# EAGLE design TwinklingPendant (EAGLE 7.6.0)

## Sheet 1 of 2
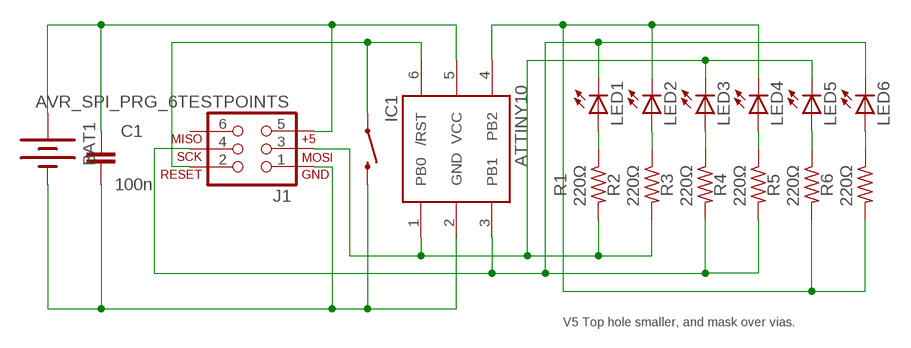
[diagram p0: schematic, sheet 1]

### Parts
BAT1  BATTERY12MM  [BATTCON_12MM]
C1  100n  CAP0603-CAP  [0603-CAP]
IC1  ATTINY10  [SOT23-6]
J1  AVR_SPI_PRG_6TESTPOINTS  [2X3_TEST_POINTS]
LED1  LEDCHIPLED_0805  [CHIPLED_0805]
LED2  LEDCHIPLED_0805  [CHIPLED_0805]
LED3  LEDCHIPLED_0805  [CHIPLED_0805]
LED4  LEDCHIPLED_0805  [CHIPLED_0805]
LED5  LEDCHIPLED_0805  [CHIPLED_0805]
LED6  LEDCHIPLED_0805  [CHIPLED_0805]
R1  220Ω  R-US_R0805  [R0805]
R2  220Ω  R-US_R0805  [R0805]
R3  220Ω  R-US_R0805  [R0805]
R4  220Ω  R-US_R0805  [R0805]
R5  220Ω  R-US_R0805  [R0805]
R6  220Ω  R-US_R0805  [R0805]
S2  SWITCH-MOMENTARY-2SMD  [TACTILE-SWITCH-SMD]

### Nets
N$1: BAT1.PWR@1(+) C1.1 IC1.5(VCC) J1.5
N$2: IC1.6(/RST) J1.2 S2.1
N$3: LED2.A R2.1
N$4: LED1.A R1.1
N$5: LED3.A R3.1
N$6: IC1.1(PB0) J1.3 LED3.C LED5.C R1.2 R2.2
N$7: BAT1.GND(-) C1.2 IC1.2(GND) J1.1 S2.3
N$8: IC1.4(PB2) LED2.C LED4.C R5.2 R6.2
N$9: LED4.A R4.1
N$11: LED5.A R5.1
N$12: LED6.A R6.1
N$14: IC1.3(PB1) J1.4 LED1.C LED6.C R3.2 R4.2
Unconnected: J1.6

### Notes on the sheet
- V5 Top hole smaller, and mask over vias.

## Sheet 2 of 2

## Library data of the parts
BAT1 = SparkFun-Electromechanical:BATTERY: Battery Holders Various common sizes : AA, AAA, 18650 (PRT-12895), 20mm coin cell and 12mm coin cell. 20MM_4LEGS, BATT-10373; PROD_ID: BATT-08044
C1 = SparkFun-Capacitors:CAP: Capacitor Standard 0603 ceramic capacitor, and 0.1" leaded capacitor.
IC1 = adafruit:ATTINY10: ATtiny4/5/9/10 8-bit Microcontroller with 512/1024 Bytes In-System Programmable Flash
J1 = technoblogy:AVR_SPI_PRG_6: AVR ISP 6 Pin This is the reduced ISP connector for AVR programming. Common on Arduino. This footprint will take up less PCB space and can be used with a 10-pin to 6-pin adapter such as SKU: BOB-08508 **Special note about "TEST_POINT" package. The stop mask is on the top side, so if you want your programming test points to be on the bottom of your board, make sure to place this package on the bottom side of the board. This also ensure that the orientation to program from the bottom side will be correct.
LED1-LED6 = adafruit:LED: LED OSRAM: - CHIPLED LG R971, LG N971, LY N971, LG Q971, LY Q971, LO R971, LY R971 LH N974, LH R974 LS Q976, LO Q976, LY Q976 LO Q996 - Hyper CHIPLED LW Q18S LB Q993, LB Q99A, LB R99A - SideLED LS A670, LO A670, LY A670, LG A670, LP A670 LB A673, LV A673, LT A673, LW A673 LH A674 LY A675 LS A676, LA A676, LO A676, LY A676, LW A676 LS A679, LY A679, LG A679 - Hyper Micro SIDELED® LS Y876, LA Y876, LO Y876, LY Y876 LT Y87S - SmartLED LW L88C, LW L88S LB L89C, LB L89S, LG L890 LS L89K, LO L89K, LY L89K LS L896, LA L896, LO L896, LY L896 - TOPLED LS T670, LO T670, LY T670, LG T670, LP T670 LSG T670, LSP T670, LSY T670, LOP T670, LYG T670 LG T671, LOG T671, LSG T671 LB T673, LV T673, LT T673, LW T673 LH T674 LS T676, LA T676, LO T676, LY T676, LB T676, LH T676, LSB T676, LW T676 LB T67C, LV T67C, LT T67C, LS T67K, LO T67K, LY T67K, LW E67C LS E67B, LA E67B, LO E67B, LY E67B, LB E67C, LV E67C, LT E67C LW T67C LS T679, LY T679, LG T679 LS T770, LO T770, LY T770, LG T770, LP T770 LB T773, LV T773, LT T773, LW T773 LH T774 LS E675, LA E675, LY E675, LS T675 LS T776, LA T776, LO T776, LY T776, LB T776 LHGB T686 LT T68C, LB T68C - Hyper Mini TOPLED® LB M676 - Mini TOPLED Santana® LG M470 LS M47K, LO M47K, LY M47K Source: http://www.osram.convergy.de/
R1-R6 = adafruit:R-US_: RESISTOR, American symbol
S2 = SparkFun-Electromechanical:SWITCH-MOMENTARY-2: Various NO switches- pushbuttons, reed, etc; PROD_ID: SWCH-08247

## Board
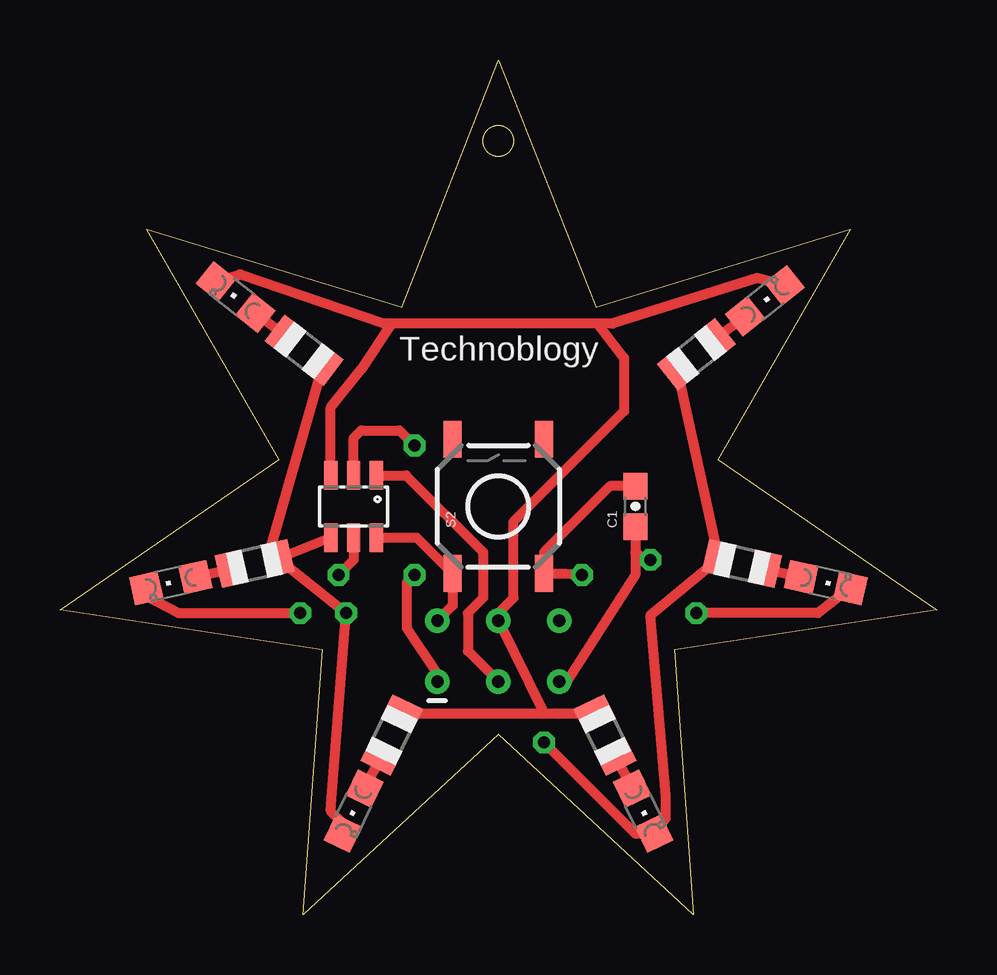
[diagram p1: board, top side]
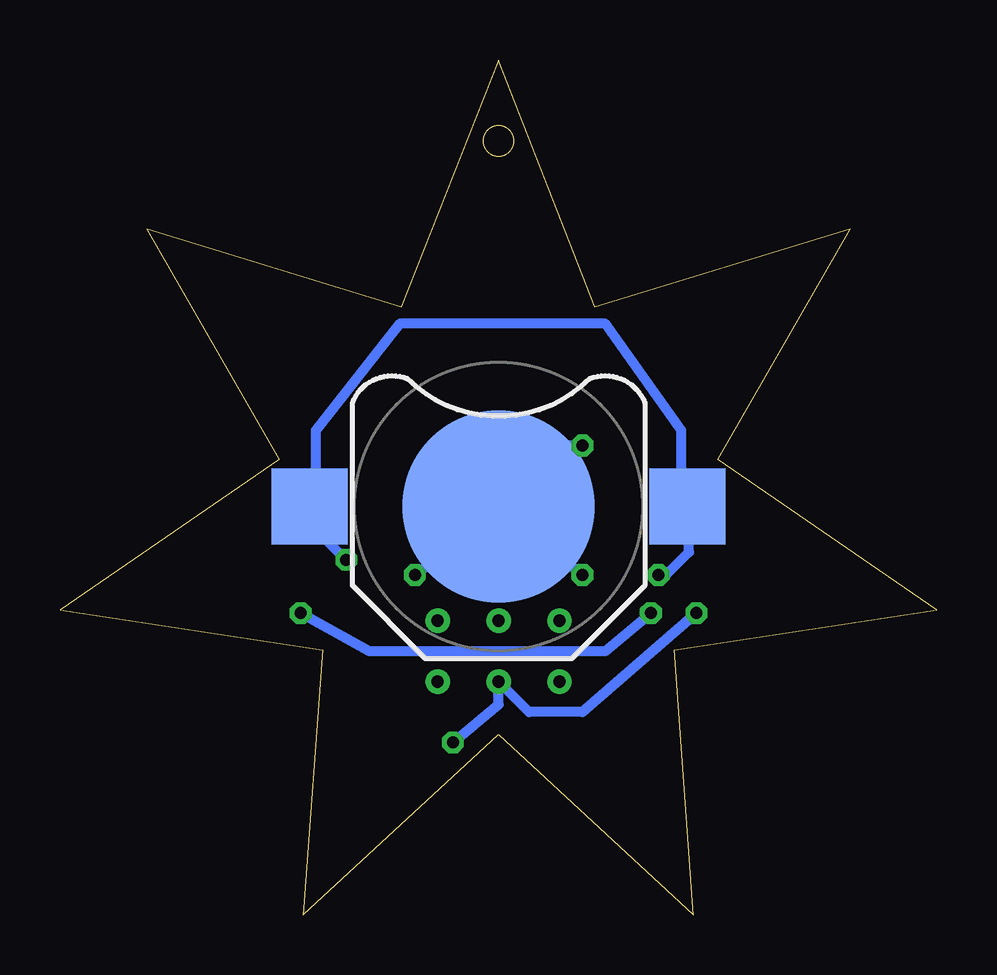
[diagram p2: board, bottom side, seen from below]

Size 36.56 x 35.64 mm. Coordinates in mm from the lower left corner, seen from the top.
Outline: 10.14,0 10.95,11.05 0,12.72 9.14,18.98 3.62,28.58 14.26,25.34 18.28,35.64 22.35,25.34 32.94,28.58 27.42,18.98 36.56,12.72 25.61,11.05 26.42,0 18.28,7.52 10.14,0
Outline: circle at 18.27,32.27 radius 0.64
Copper layers (1*16): Top 0.035mm / dielectric 1.5mm / Bottom 0.035mm
Design rules "default *": minimum track width 10mil, minimum drill 24mil, track to track 8mil, track to pad 8mil, pad to pad 8mil, via to via 8mil, smd to smd 8mil, copper to edge 40mil, drill to drill 8mil, minimum pad ring 10mil, minimum via ring 8mil, stop-mask expansion 4mil, vias tented up to drill 20mil, thermal gap 10mil

### Footprints (pad centres in the part's own frame; a part is rotated, then mirrored left to right if it is on the bottom)
BATTCON_12MM = smd 8 x 8: GND 0,0 | smd 3.175 x 3.175: PWR@1 -7.874,0; PWR@2 7.874,0
0603-CAP = smd 1.1 x 1: 1 -0.85,0; 2 0.85,0
SOT23-6 = smd 0.55 x 1.2: 1 -0.95,-1.3; 2 0,-1.3; 3 0.95,-1.3; 4 0.95,1.3; 5 0,1.3; 6 -0.95,1.3
2X3_TEST_POINTS = drill 0.508: 1 -2.54,-1.27; 2 -2.54,1.27; 3 0,-1.27; 4 0,1.27; 5 2.54,-1.27; 6 2.54,1.27
CHIPLED_0805 = smd 1.2 x 1.2: A 0,-1.05; C 0,1.05
R0805 = smd 1.1 x 1.4: 1 -1,0; 2 1,0
TACTILE-SWITCH-SMD = smd 1.524 x 0.762: 1 -2.794,1.905; 2 2.794,1.905; 3 -2.794,-1.905; 4 2.794,-1.905

### Placement (x,y rotation side)
BAT1  18.27,17.03 0 bottom
C1  23.99,17.03 90 top
IC1  12.24,17.03 180 top
J1  18.27,11 0 top
LED1  29.39,25.6 308.5 top
LED2  31.93,13.86 257.2 top
LED3  24.31,4.33 205.8 top
LED4  12.24,4.33 154.2 top
LED5  4.62,13.86 102.8 top
LED6  7.32,25.76 51.4 top
R1  26.53,23.38 218.5 top
R2  28.43,14.65 167.2 top
R3  22.72,7.51 115.8 top
R4  13.83,7.51 64.2 top
R5  8.11,14.65 12.8 top
R6  10.18,23.54 322.5 top
S2  18.27,17.03 90 top

### Tracks (layer width: path | path; a pad name or v marks a point on that pad's centre or on a via)
N$1  (via drill 0.5)
  Top 0.406: J1.5 21.13,9.73 23.99,14.17 23.99,15.13 | C1.1 23.99,15.13 | v24.62,14.81 24.31,14.81 23.99,15.13 | IC1.5 12.24,14.81 v11.61,14.17
  Bottom 0.406: v24.62,14.81 26.15,16.33 BAT1.PWR@1 25.89,17.28 25.89,20.21 22.4,24.65 13.83,24.65 10.65,20.21 10.65,18.62 10.02,16.4 10.34,16.08 10.34,15.13 11.29,14.17 v11.61,14.17
N$2
  Top 0.406: IC1.6 14.87,15.73 S2.1 16.37,12.9 J1.2
N$3
  Top 0.406: R2.1 LED2.A
N$4
  Top 0.406: LED1.A R1.1
N$5
  Top 0.406: R3.1 LED3.A
N$6  (via drill 0.5)
  Top 0.406: R1.2 R2.2 24.62,12.51 25.26,4.97 25.26,4.01 25.07,3.83 25.07,3.7 LED3.C 23.98,3.39 v20.18,7.19 | IC1.1 14.43,18.33 17.64,15.13 17.64,13.22 17,12.59 17,11 J1.3 | LED5.C 3.6,13.29 4.94,12.59 v10.02,12.59
  Bottom 0.406: v20.18,7.19 18.27,8.78 J1.3 17,8.46 14.78,8.46 v10.02,12.59
N$7  (via drill 0.5)
  Top 0.406: J1.1 15.73,10.05 14.46,11.95 14.46,13.86 v14.78,14.17 | C1.2 22.93,17.88 20.18,15.13 S2.3 21.07,14.24 v21.77,14.17 | IC1.2 12.24,19.89 12.56,20.21 14.15,20.21 v14.78,19.57
  Bottom 0.406: v21.77,14.17 18.91,16.4 | 18.91,16.4 BAT1.GND 15.73,19.57 v14.78,19.57 | v14.78,14.17 17.64,16.4 18.91,16.4
N$8  (via drill 0.5)
  Top 0.406: R5.2 IC1.4 | LED4.C 11.78,3.83 11.29,4.33 v11.92,12.59 R5.2 | v26.53,12.59 31.61,12.59 LED2.C | R5.2 8.75,15.13 R6.2
  Bottom 0.406: v26.53,12.59 23.67,11 13.83,11 v11.92,12.59
N$9
  Top 0.406: R4.1 LED4.A
N$11
  Top 0.406: LED5.A R5.1
N$12
  Top 0.406: LED6.A R6.1
N$14
  Top 0.406: IC1.3 11.29,21.16 12.56,22.75 13.83,24.65 | R4.2 20.18,8.41 | 20.18,8.41 R3.2 | 20.18,8.41 J1.4 18.27,12.59 18.91,13.22 18.91,16.4 23.51,21 23.51,23.22 22.4,24.65 | LED1.C 29.07,26.56 23.04,24.65 22.4,24.65 | 22.4,24.65 13.83,24.65 | 13.83,24.65 13.51,24.65 7.53,26.7 | 7.48,26.71 7.53,26.7 | LED6.C 7.53,26.7

### Text on the board
tPlace: Technoblogy